# Altium schematic sheet Power.SchDoc
size A
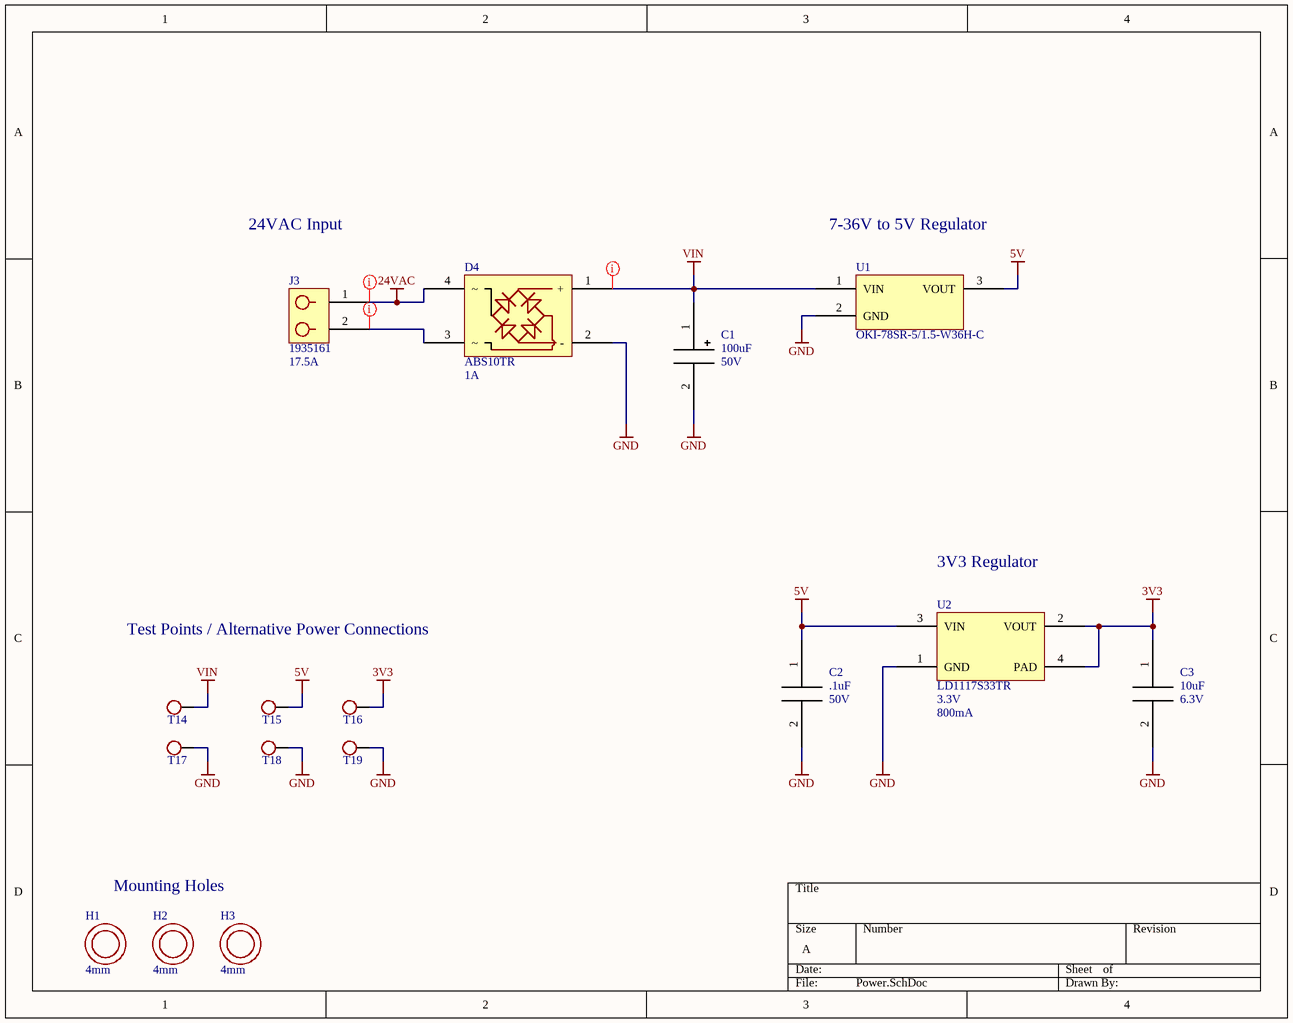
[diagram p0: Power.SchDoc]

## Parts
C1  value 100uF  Rating: 50V  [EEE-1HA101UP]  (hidden comment: CAP)
C2  value .1uF  Rating: 50V  [0603]  (hidden comment: *)
C3  value 10uF  Rating: 6.3V  [0603]  (hidden comment: *)
D4  Rating: 1A  PartNumber: ABS10TR  [ABS]  (hidden comment: D_RECTBRIDGE_ABS)
H1  value 4mm  [MOUNTHOLE4MM]  (hidden comment: H_MOUNTHOLE_MOUNTHOLE4MM)
H2  value 4mm  [MOUNTHOLE4MM]  (hidden comment: H_MOUNTHOLE_MOUNTHOLE4MM)
H3  value 4mm  [MOUNTHOLE4MM]  (hidden comment: H_MOUNTHOLE_MOUNTHOLE4MM)
J3  Rating: 17.5A  [1935161]  (hidden comment: J_2POSTERM_1935161)
T14  TESTPOINT  [TESTPOINT1MM]  (value not drawn)
T15  TESTPOINT  [TESTPOINT1MM]  (value not drawn)
T16  TESTPOINT  [TESTPOINT1MM]  (value not drawn)
T17  TESTPOINT  [TESTPOINT1MM]  (value not drawn)
T18  TESTPOINT  [TESTPOINT1MM]  (value not drawn)
T19  TESTPOINT  [TESTPOINT1MM]  (value not drawn)
U1  U_OKI-78SR-5/1.5-W36H-C_OKI-78SR-5/1.5-W36H-C  [OKI-78SR-5/1.5-W36H-C]  (value not drawn)
U2  value 3.3V  Rating: 800mA  PartNumber: LD1117S33TR  [SOT223]  (hidden comment: U_LD1117S33TR_SOT223)

## Nets
3V3: C3.1 T16.1 U2.2(VOUT) U2.4(PAD)
5V: C2.1 T15.1 U1.3(VOUT) U2.3(VIN)
24VAC: D4.4 J3.1
GND: C1.2 C2.2 C3.2 D4.2(-) T17.1 T18.1 T19.1 U1.2(GND) U2.1(GND)
VIN: C1.1 D4.1(+) T14.1 U1.1(VIN)
NetD4_3: D4.3 J3.2

## Layout directives
rule Clearance Constraint [Generic clearance = 25mil, and 9 value(s) for objects]; rule Width Constraint [Pref Width = 25mil    Min Width = 15mil    Max Width = 25mil]: 24VAC, NetD4_3, VIN

## Notes on the sheet
- 24VAC Input
- 7-36V to 5V Regulator
- 3V3 Regulator
- Test Points / Alternative Power Connections
- Mounting Holes

## Library data of the parts
C1 = C_CAP-P_EEE-1HA101UP: Manufacturer: Panasonic Electronic Components; PartNumber: EEE-1HA101UP
C2 = C_CAP_0603: PartNumber: C0603C104K5RACAUTO; Manufacturer: KEMET
C3 = C_CAP_0603: PartNumber: JMK107ABJ106MA-T; Manufacturer: Taiyo Yuden
D4 = D_RECTBRIDGE_ABS: Manufacturer: SMC Diode Solutions
J3 = J_2POSTERM_1935161: Manufacturer: Phoenix Contact; PartNumber: 1935161
T14-T19 = T_TESTPOINT_TESTPOINT1MM: Value: 1mm
U1 = U_OKI-78SR-5/1.5-W36H-C_OKI-78SR-5/1.5-W36H-C: Manufacturer: Murata Power Solutions Inc.; Rating: 1.5A; PartNumber: OKI-78SR-5/1.5-W36H-C